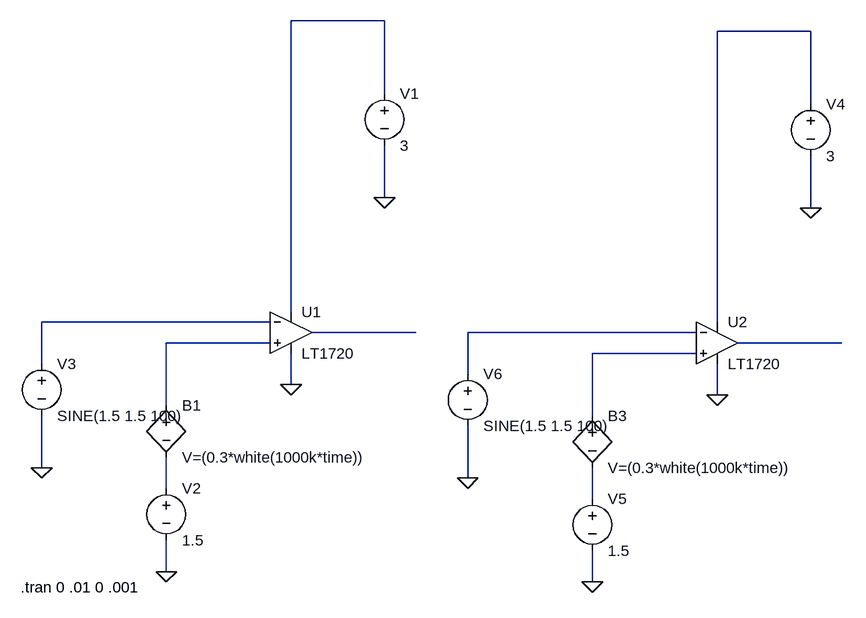
[diagram p0: schematic Comparator Chatter Example.asc]
Comparator Chatter Example.asc, the LTspice schematic file:
Version 4
SHEET 1 1348 680
WIRE 336 -352 192 -352
WIRE 992 -336 848 -336
WIRE 336 -240 336 -352
WIRE 992 -224 992 -336
WIRE 336 -80 336 -160
WIRE 992 -64 992 -144
WIRE 192 96 192 -352
WIRE 160 112 -192 112
WIRE 848 112 848 -336
WIRE 384 128 224 128
WIRE 816 128 464 128
WIRE 160 144 0 144
WIRE 1040 144 880 144
WIRE 816 160 656 160
WIRE -192 176 -192 112
WIRE 464 192 464 128
WIRE 192 208 192 160
WIRE 848 224 848 176
WIRE 0 240 0 144
WIRE 656 256 656 160
WIRE -192 336 -192 256
WIRE 464 352 464 272
WIRE 0 368 0 320
WIRE 656 384 656 336
WIRE 0 496 0 448
WIRE 656 512 656 464
FLAG 336 -80 0
FLAG 0 496 0
FLAG -192 336 0
FLAG 192 208 0
FLAG 992 -64 0
FLAG 656 512 0
FLAG 464 352 0
FLAG 848 224 0
SYMBOL Comparators\\LT1720 192 64 R0
SYMATTR InstName U1
SYMBOL voltage 336 -256 R0
WINDOW 123 0 0 Left 0
WINDOW 39 0 0 Left 0
SYMATTR InstName V1
SYMATTR Value 3
SYMBOL voltage 0 352 R0
WINDOW 123 0 0 Left 0
WINDOW 39 0 0 Left 0
SYMATTR InstName V2
SYMATTR Value 1.5
SYMBOL bv 0 224 R0
SYMATTR InstName B1
SYMATTR Value V=(0.3*white(1000k*time))
SYMBOL voltage -192 160 R0
WINDOW 123 0 0 Left 0
WINDOW 39 0 0 Left 0
SYMATTR InstName V3
SYMATTR Value SINE(1.5 1.5 100)
SYMBOL Comparators\\LT1720 848 80 R0
SYMATTR InstName U2
SYMBOL voltage 992 -240 R0
WINDOW 123 0 0 Left 0
WINDOW 39 0 0 Left 0
SYMATTR InstName V4
SYMATTR Value 3
SYMBOL voltage 656 368 R0
WINDOW 123 0 0 Left 0
WINDOW 39 0 0 Left 0
SYMATTR InstName V5
SYMATTR Value 1.5
SYMBOL bv 656 240 R0
SYMATTR InstName B3
SYMATTR Value V=(0.3*white(1000k*time))
SYMBOL voltage 464 176 R0
WINDOW 123 0 0 Left 0
WINDOW 39 0 0 Left 0
SYMATTR InstName V6
SYMATTR Value SINE(1.5 1.5 100)
TEXT -224 520 Left 2 !.tran 0 .01 0 .001

The netlist it stands for:
* Comparator Chatter Example.asc
XU1 N006 N003 N001 0 N004 LT1720  ; pins In+ In- V+ V- OUT
V1 N001 0 3
V2 N009 0 1.5
B1 N006 N009 V=(0.3*white(1000k*time))
V3 N003 0 SINE(1.5 1.5 100)
XU2 N008 N005 N002 0 N007 LT1720  ; pins In+ In- V+ V- OUT
V4 N002 0 3
V5 N010 0 1.5
B3 N008 N010 V=(0.3*white(1000k*time))
V6 N005 0 SINE(1.5 1.5 100)
.tran 0 .01 0 .001
.lib LT1720.sub
.backanno
.end